# Altium schematic sheet Cap 1uF 16V.schdoc
size 127 x 101 mm
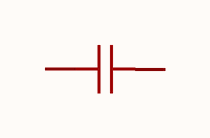
[diagram p0: Cap 1uF 16V.schdoc]

## Parts
C?  1uF  [C0603]  (value not drawn)

## Nets

Not connected (* = marked no-connect by the designer): C? 1 2

## Library data of the parts
C? = GCM188R71C105KA64D: Manufacturer: muRata(村田); Add into BOM: yes; Tolerance: ±10%; Symbol: GCM188R71C105KA64D; Device: GCM188R71C105KA64D; LCSC Part Name: 1uF ±10% 16V; Supplier Part: C161212; Manufacturer Part: GCM188R71C105KA64D; Supplier Footprint: 0603; JLCPCB Part Class: Extended Part; Datasheet: https://atta.szlcsc.com/upload/public/pdf/source/20181221/C161212_C96DD77354D5551432B3B7779E4D1948.pdf; Supplier: LCSC; Convert to PCB: yes; Value: 1uF